# EAGLE design PFC_nano_breakout (EAGLE 7.6.0)
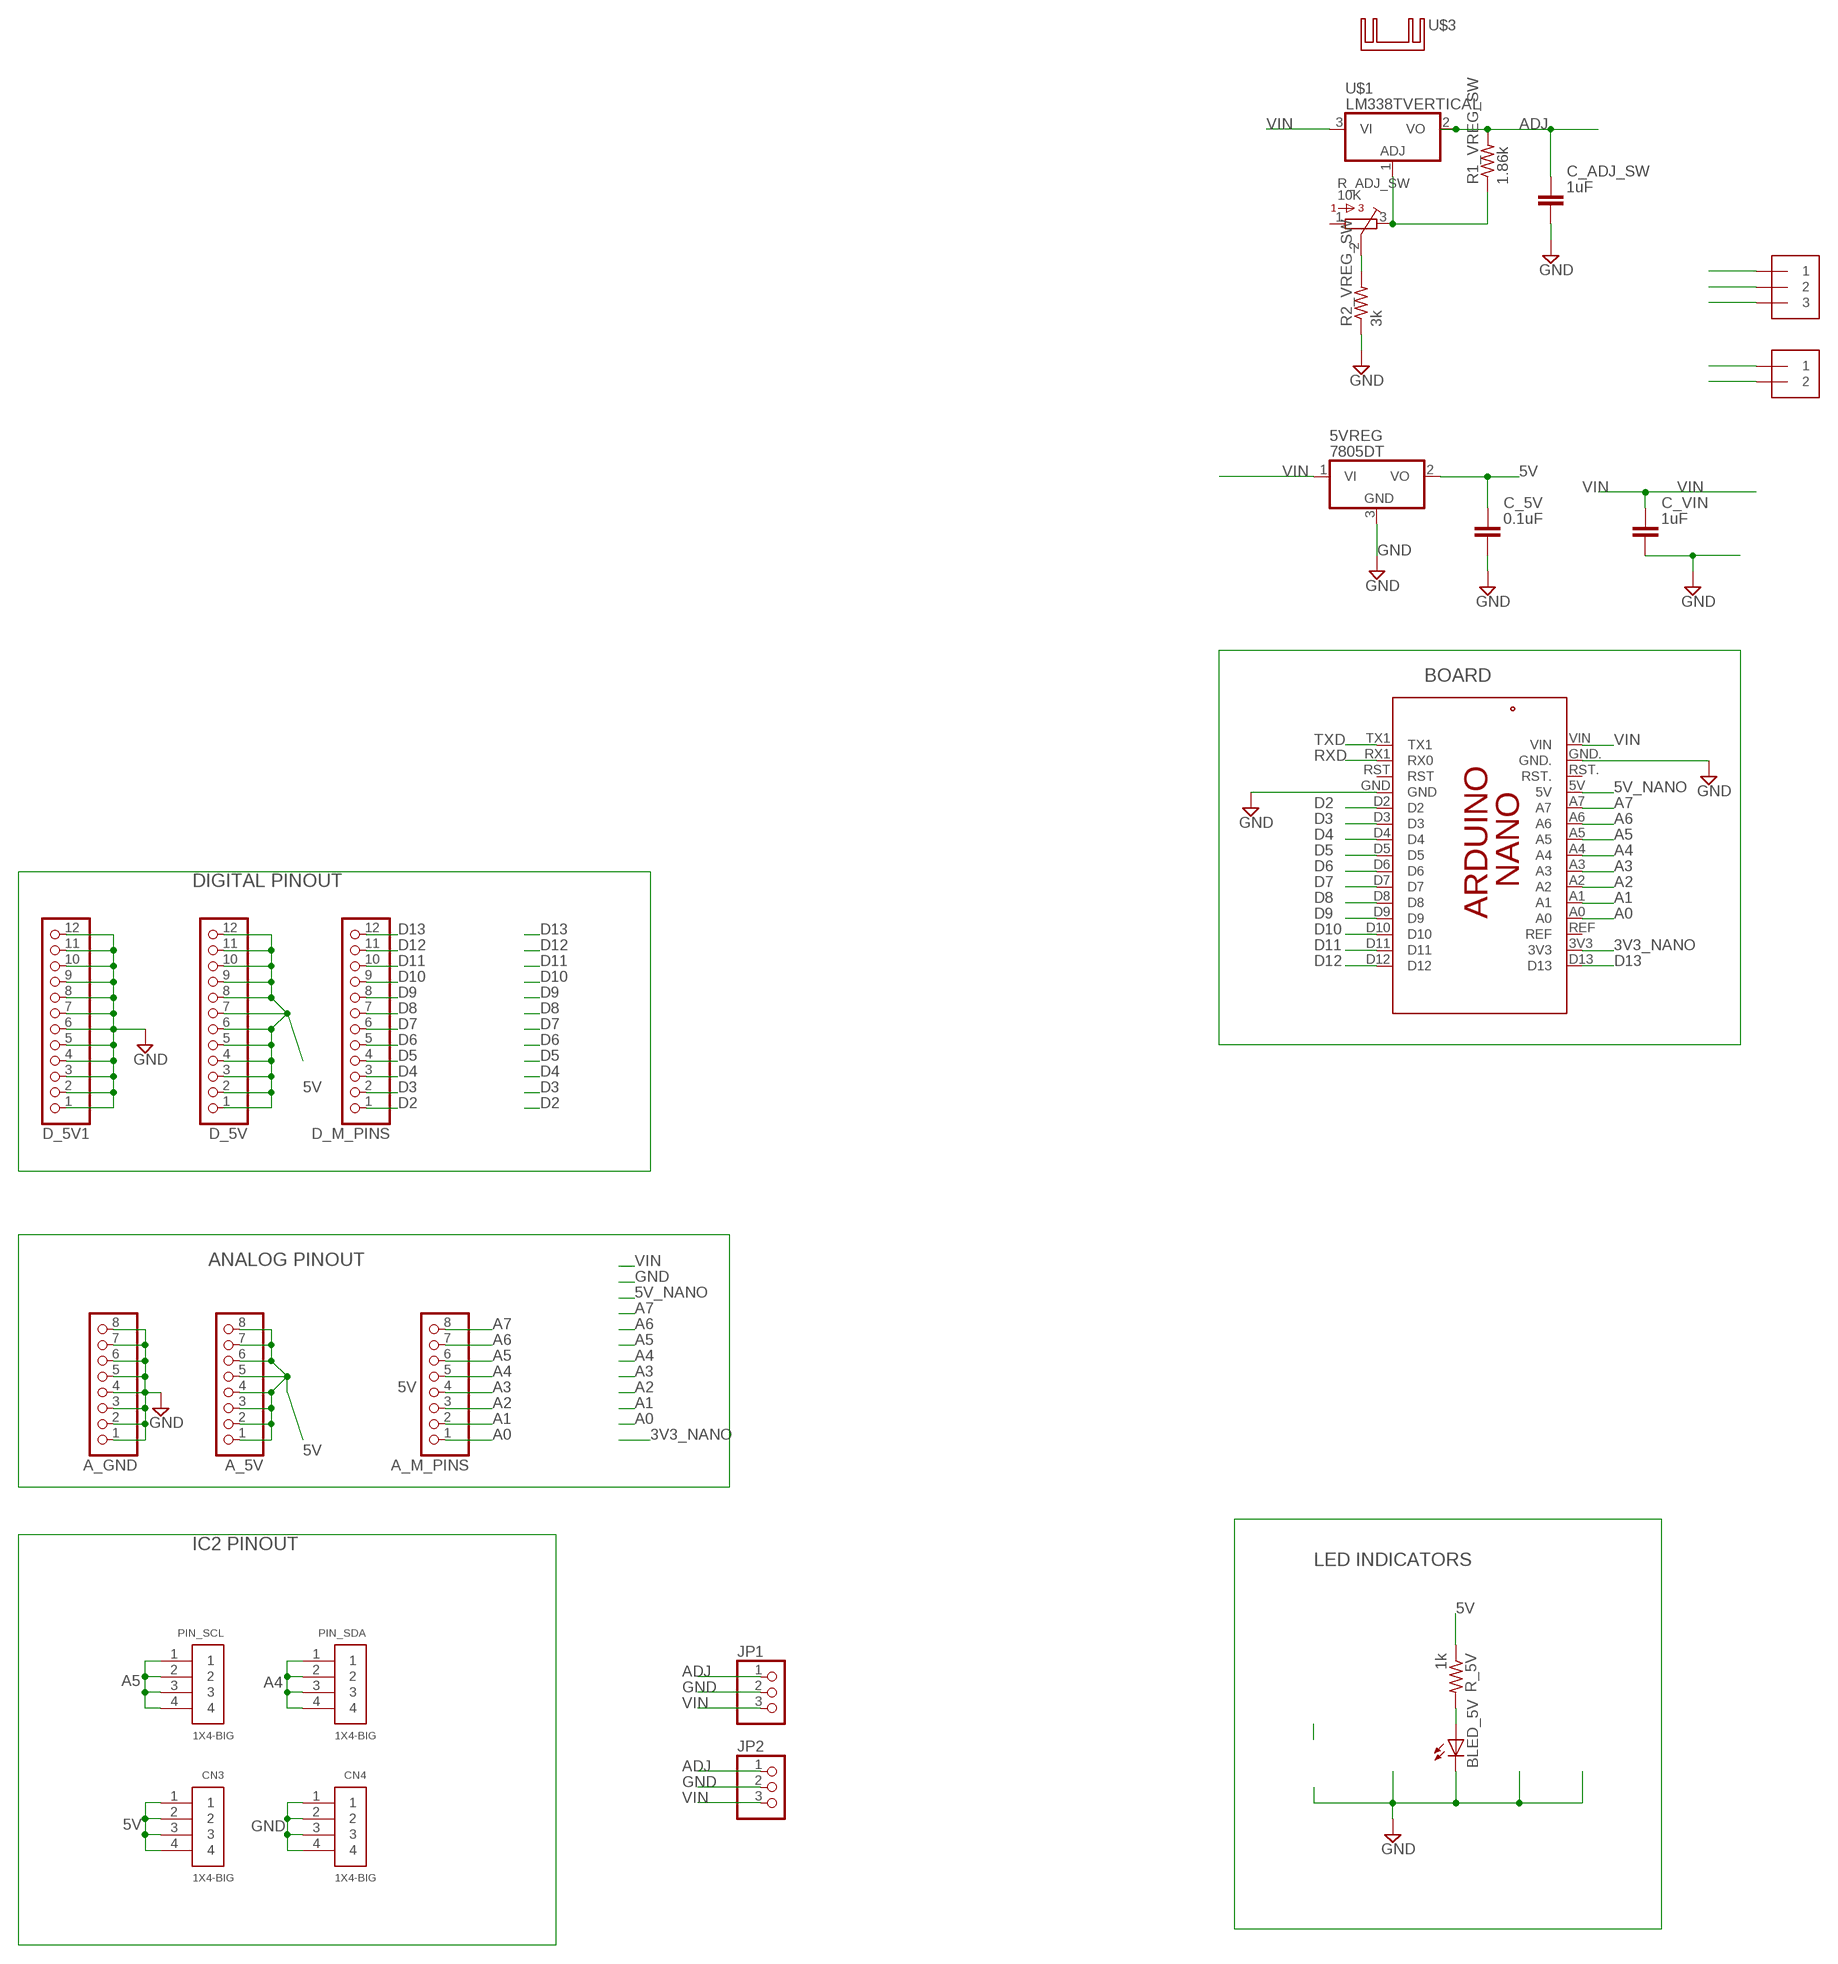
[diagram p0: schematic, sheet 1]

## Parts
5VREG  7805DT  [TO252]
A_5V  PINHD-1X8CLEANBIG  [1X08-CLEANBIG]
A_GND  PINHD-1X8CLEANBIG  [1X08-CLEANBIG]
A_M_PINS  PINHD-1X8CLEANBIG  [1X08-CLEANBIG]
BLED_5V  LEDCHIP-LED0603  [CHIP-LED0603]
C_5V  0.1uF  CAPACITOR_NPOL-0603  [C603]
C_ADJ_SW  1uF  CAPACITOR_NPOL-0603  [C603]
C_VIN  1uF  CAPACITOR_NPOL-0603  [C603]
CN3  1X4-BIG  [1X04-BIG]
CN4  1X4-BIG  [1X04-BIG]
D_5V  PINHD-1X12-CB  [1X12-CB]
D_5V1  PINHD-1X12-CB  [1X12-CB]
D_M_PINS  PINHD-1X12-CB  [1X12-CB]
J2  1X2-3.5MM  [1X2-3.5MM]
JP1  PINHD-1X3CB  [1X03-CLEANBIG]
JP2  PINHD-1X3CB  [1X03-CLEANBIG]
PCB1  ARDUINO_NANO_SHIELD  [ARDUINO_NANO_SHIELD]
PIN_SCL  1X4-BIG  [1X04-BIG]
PIN_SDA  1X4-BIG  [1X04-BIG]
R1_VREG_SW  1.86k  R-US_R0603  [R0603]
R2_VREG_SW  3k  R-US_R0603  [R0603]
R_5V  1k  R-US_R0603  [R0603]
R_ADJ_SW  10K  3386-P  [3386P]
U$1  LM338TVERTICAL  [TO220V]
U$2  1X3  [1X3-3.5MM]
U$3  FW1S  [FW1S-DOCU]

## Nets
3V3_NANO: PCB1.3V3
5V: 5VREG.2(VO) A_5V.1 A_5V.2 A_5V.3 A_5V.4 A_5V.5 A_5V.6 A_5V.7 A_5V.8 C_5V.1 CN3.1 CN3.2 CN3.3 CN3.4 D_5V.1 D_5V.2 D_5V.3 D_5V.4 D_5V.5 D_5V.6 D_5V.7 D_5V.8 D_5V.9 D_5V.10 D_5V.11 D_5V.12 R_5V.1
5V_NANO: PCB1.5V
A0: A_M_PINS.1 PCB1.A0
A1: A_M_PINS.2 PCB1.A1
A2: A_M_PINS.3 PCB1.A2
A3: A_M_PINS.4 PCB1.A3
A4: A_M_PINS.5 PCB1.A4 PIN_SDA.1 PIN_SDA.2 PIN_SDA.3 PIN_SDA.4
A5: A_M_PINS.6 PCB1.A5 PIN_SCL.1 PIN_SCL.2 PIN_SCL.3 PIN_SCL.4
A6: A_M_PINS.7 PCB1.A6
A7: A_M_PINS.8 PCB1.A7
ADJ: C_ADJ_SW.1 JP1.1 JP2.1 R1_VREG_SW.2 U$1.2(VO) U$2.2
D2: D_M_PINS.1 PCB1.D2
D3: D_M_PINS.2 PCB1.D3
D4: D_M_PINS.3 PCB1.D4
D5: D_M_PINS.4 PCB1.D5
D6: D_M_PINS.5 PCB1.D6
D7: D_M_PINS.6 PCB1.D7
D8: D_M_PINS.7 PCB1.D8
D9: D_M_PINS.8 PCB1.D9
D10: D_M_PINS.9 PCB1.D10
D11: D_M_PINS.10 PCB1.D11
D12: D_M_PINS.11 PCB1.D12
D13: D_M_PINS.12 PCB1.D13
GND: 5VREG.3(GND) A_GND.1 A_GND.2 A_GND.3 A_GND.4 A_GND.5 A_GND.6 A_GND.7 A_GND.8 BLED_5V.C C_5V.2 C_ADJ_SW.2 C_VIN.2 CN4.1 CN4.2 CN4.3 CN4.4 D_5V1.1 D_5V1.2 D_5V1.3 D_5V1.4 D_5V1.5 D_5V1.6 D_5V1.7 D_5V1.8 D_5V1.9 D_5V1.10 D_5V1.11 D_5V1.12 J2.1 JP1.2 JP2.2 PCB1.GND PCB1.GND. R2_VREG_SW.1 U$2.1
N$2: R2_VREG_SW.2 R_ADJ_SW.2
N$4: BLED_5V.A R_5V.2
N$5: R1_VREG_SW.1 R_ADJ_SW.3 U$1.1(GND)
RXD: PCB1.RX1(RX0)
TXD: PCB1.TX1
VIN: 5VREG.1(VI) C_VIN.1 J2.2 JP1.3 JP2.3 PCB1.VIN U$1.3(VI) U$2.3
Unconnected: PCB1.REF PCB1.RST PCB1.RST. R_ADJ_SW.1

## Notes on the sheet
- BOARD
- DIGITAL PINOUT
- ANALOG PINOUT
- IC2 PINOUT
- LED INDICATORS

## Library data of the parts
5VREG = adafruit:78*: Positive VOLTAGE REGULATOR Added bigger pads to the TO-92 package
A_5V A_GND A_M_PINS = adafruit:PINHD-1X8: PIN HEADER
BLED_5V = led:LED: LED OSRAM: - CHIPLED LG R971, LG N971, LY N971, LG Q971, LY Q971, LO R971, LY R971 LH N974, LH R974 LS Q976, LO Q976, LY Q976 LO Q996 - Hyper CHIPLED LW Q18S LB Q993, LB Q99A, LB R99A - SideLED LS A670, LO A670, LY A670, LG A670, LP A670 LB A673, LV A673, LT A673, LW A673 LH A674 LY A675 LS A676, LA A676, LO A676, LY A676, LW A676 LS A679, LY A679, LG A679 - Hyper Micro SIDELED® LS Y876, LA Y876, LO Y876, LY Y876 LT Y87S - SmartLED LW L88C, LW L88S LB L89C, LB L89S, LG L890 LS L89K, LO L89K, LY L89K LS L896, LA L896, LO L896, LY L896 - TOPLED LS T670, LO T670, LY T670, LG T670, LP T670 LSG T670, LSP T670, LSY T670, LOP T670, LYG T670 LG T671, LOG T671, LSG T671 LB T673, LV T673, LT T673, LW T673 LH T674 LS T676, LA T676, LO T676, LY T676, LB T676, LH T676, LSB T676, LW T676 LB T67C, LV T67C, LT T67C, LS T67K, LO T67K, LY T67K, LW E67C LS E67B, LA E67B, LO E67B, LY E67B, LB E67C, LV E67C, LT E67C LW T67C LS T679, LY T679, LG T679 LS T770, LO T770, LY T770, LG T770, LP T770 LB T773, LV T773, LT T773, LW T773 LH T774 LS E675, LA E675, LY E675, LS T675 LS T776, LA T776, LO T776, LY T776, LB T776 LHGB T686 LT T68C, LB T68C - Hyper Mini TOPLED® LB M676 - Mini TOPLED Santana® LG M470 LS M47K, LO M47K, LY M47K Source: http://www.osram.convergy.de LUXEON: - LUMILED® LXK2-PW12-R00, LXK2-PW12-S00, LXK2-PW14-U00, LXK2-PW14-V00 LXK2-PM12-R00, LXK2-PM12-S00, LXK2-PM14-U00 LXK2-PE12-Q00, LXK2-PE12-R00, LXK2-PE12-S00, LXK2-PE14-T00, LXK2-PE14-U00 LXK2-PB12-K00, LXK2-PB12-L00, LXK2-PB12-M00, LXK2-PB14-N00, LXK2-PB14-P00, LXK2-PB14-Q00 LXK2-PR12-L00, LXK2-PR12-M00, LXK2-PR14-Q00, LXK2-PR14-R00 LXK2-PD12-Q00, LXK2-PD12-R00, LXK2-PD12-S00 LXK2-PH12-R00, LXK2-PH12-S00 LXK2-PL12-P00, LXK2-PL12-Q00, LXK2-PL12-R00 Source: www.luxeon.com KINGBRIGHT: KA-3528ASYC Source: www.kingbright.com
C_5V C_ADJ_SW C_VIN = dp_devices:CAPACITOR_NPOL: Non-Polarized capacitor in various packages
CN3 CN4 PIN_SCL PIN_SDA = adafruit:1X4: 4-pin connector
D_5V D_5V1 D_M_PINS = adafruit:PINHD-1X12: PIN HEADER
J2 = adafruit:1X2: 3.5mm Terminal block http://www.ladyada.net/library/pcb/eaglelibrary.html
JP1 JP2 = adafruit:PINHD-1X3: PIN HEADER
PCB1 = E14_Arduino_revC:ARDUINO_NANO_SHIELD: Arduino Nano pinout for making a shield
R1_VREG_SW R2_VREG_SW R_5V = resistor:R-US_: RESISTOR, American symbol
R_ADJ_SW = bourns:3386-: 3386 Series 3/8" Square Trimmer
U$1 = Texas Instruments_By_element14_Batch_1:LM338T
U$2 = adafruit:1X3: 3.5mm Terminal Block
U$3 = heatsink:FW1S: Heat Sink for TO220

## Board
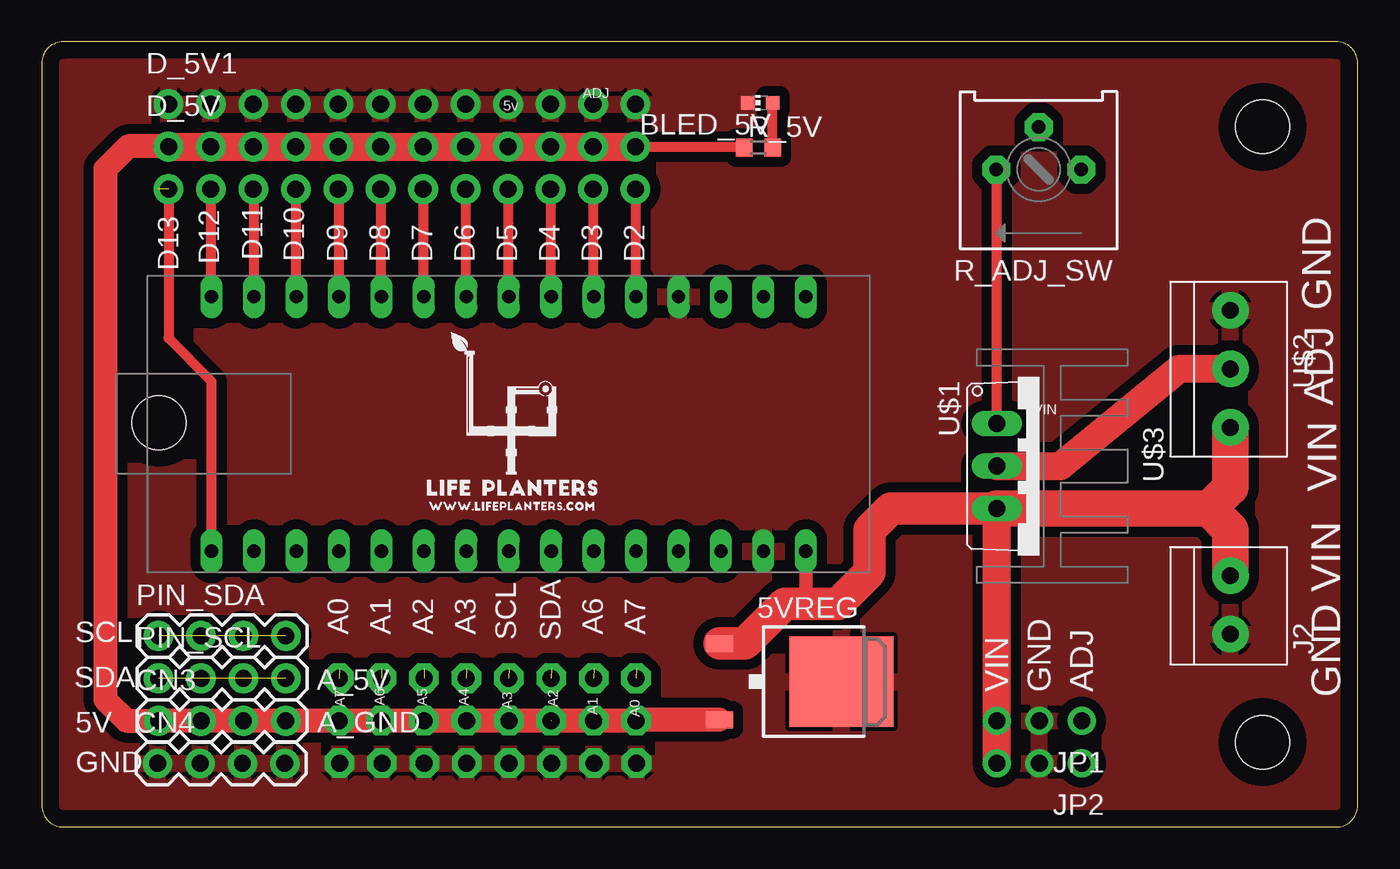
[diagram p1: board, top side]
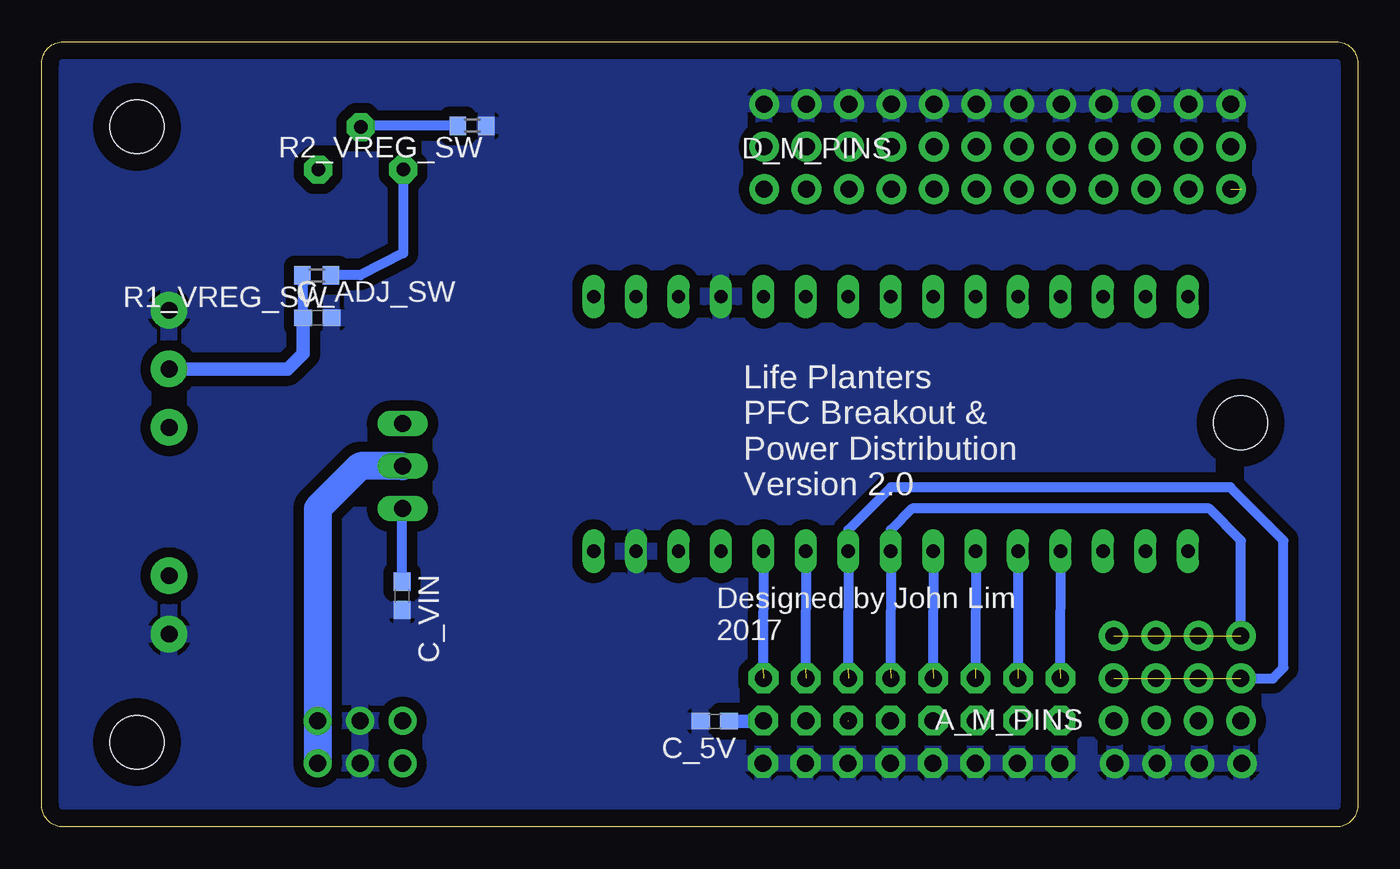
[diagram p2: board, bottom side, seen from below]

Size 78.74 x 46.99 mm. Coordinates in mm from the lower left corner, seen from the top.
Outline: 1.27,0 77.47,0 arc90 78.74,1.27 78.74,45.72 arc90 77.47,46.99 1.27,46.99 arc90 0,45.72 0,1.27 arc90 1.27,0
Copper layers (1*16): Top 0.035mm / dielectric 1.5mm / Bottom 0.035mm
Design rules "default": minimum track width 10mil, minimum drill 24mil, track to track 8mil, track to pad 8mil, pad to pad 8mil, via to via 8mil, smd to smd 8mil, copper to edge 40mil, drill to drill 8mil, minimum pad ring 10mil, minimum via ring 8mil, stop-mask expansion 4mil, vias tented up to drill 0mil, thermal gap 10mil
Holes 3.2 mm at 73.05,41.9 73.04,5.07 7.01,24.19

### Footprints (pad centres in the part's own frame; a part is rotated, then mirrored left to right if it is on the bottom)
TO252 = smd 1 x 1.6: 1 -2.28,-4.8; 2 2.28,-4.8 | smd 5.4 x 6.2: 3 0,2.5
1X08-CLEANBIG = drill 1.016 pad 1.778 octagon: 1 -8.89,0; 2 -6.35,0; 3 -3.81,0; 4 -1.27,0; 5 1.27,0; 6 3.81,0; 7 6.35,0; 8 8.89,0
CHIP-LED0603 = smd 0.8 x 0.8: A 0,-0.75; C 0,0.75
C603 = smd 1.1 x 1: 1 -0.85,0; 2 0.85,0
1X04-BIG = drill 1.016 pad 1.778: 1 0,0; 2 2.54,0; 3 5.08,0; 4 7.62,0
1X12-CB = drill 1.016 pad 1.778: 1 -13.97,0; 2 -11.43,0; 3 -8.89,0; 4 -6.35,0; 5 -3.81,0; 6 -1.27,0; 7 1.27,0; 8 3.81,0; 9 6.35,0; 10 8.89,0; 11 11.43,0; 12 13.97,0
1X2-3.5MM = drill 1 pad 2.184: 1 1.8,0; 2 -1.7,0
1X03-CLEANBIG = drill 1.016 pad 1.676: 1 -2.54,0; 2 0,0; 3 2.54,0
ARDUINO_NANO_SHIELD = drill 0.8 long: 3V3 -13.97,-7.62; 5V 11.43,-7.62; A0 -8.89,-7.62; A1 -6.35,-7.62; A2 -3.81,-7.62; A3 -1.27,-7.62; A4 1.27,-7.62; A5 3.81,-7.62; A6 6.35,-7.62; A7 8.89,-7.62; D2 8.89,7.62; D3 6.35,7.62; D4 3.81,7.62; D5 1.27,7.62; D6 -1.27,7.62; D7 -3.81,7.62; D8 -6.35,7.62; D9 -8.89,7.62; D10 -11.43,7.62; D11 -13.97,7.62; D12 -16.51,7.62; D13 -16.51,-7.62; GND 11.43,7.62; GND. 16.51,-7.62; REF -11.43,-7.62; RST 13.97,7.62; RST. 13.97,-7.62; RX1 16.51,7.62; TX1 19.05,7.62; VIN 19.05,-7.62
R0603 = smd 1 x 1.1: 1 -0.85,0; 2 0.85,0
3386P = drill 0.813 pad 1.676 octagon: 1 -2.54,0; 2 0,-2.54; 3 2.54,0
TO220V = drill 1.016 long: 1 -2.54,1.27; 2 0,1.27; 3 2.54,1.27
1X3-3.5MM = drill 1 pad 2.184: 1 2.11,3.81; 2 5.61,3.81; 3 9.11,3.81

### Placement (x,y rotation side)
5VREG  45.35,8.69 270 top
A_5V  26.68,6.36 0 top
A_GND  26.7,3.82 0 top
A_M_PINS  26.67,8.9 180 bottom
BLED_5V  42.99,43.33 90 top
C_5V  38.47,6.33 180 bottom
C_ADJ_SW  62.25,30.46 0 bottom
C_VIN  57.19,13.84 270 bottom
CN3  6.99,6.35 0 top
CN4  6.92,3.8 0 top
D_5V  21.55,40.71 0 top
D_5V1  21.55,43.25 0 top
D_M_PINS  21.55,38.17 0 bottom
J2  71.12,13.34 270 top
JP1  59.69,6.34 180 top
JP2  59.69,3.81 180 top
PCB1  26.67,24.12 0 top
PIN_SCL  6.99,8.89 0 top
PIN_SDA  6.99,11.43 0 top
R1_VREG_SW  62.29,33 180 bottom
R2_VREG_SW  52.99,41.96 180 bottom
R_5V  42.88,40.65 0 top
R_ADJ_SW  59.65,39.35 180 top
U$1  55.88,21.59 270 top
U$2  67.31,33.02 270 top
U$3  60.96,21.59 270 top

### Tracks (layer width: path | path; a pad name or v marks a point on that pad's centre or on a via)
5V  (1 unrouted)
  Top 0.61: D_5V.12 41.97,40.71 R_5V.1
  Top 1.422: 7.55,40.74 5.18,40.74 3.81,39.37 3.81,7.62 5.08,6.35 CN3.1 CN3.2 CN3.3 CN3.4 13.98,6.36 A_5V.1 A_5V.2 A_5V.3 A_5V.4 A_5V.5 | A_5V.5 A_5V.6 A_5V.7 A_5V.8 35.62,6.41 5VREG.2 | A_5V.5
  Top 1.676: 7.55,40.74 D_5V.1 D_5V.2 D_5V.3 D_5V.4 D_5V.5 D_5V.6 D_5V.7 D_5V.8 D_5V.9 D_5V.10 D_5V.11 D_5V.12
  Bottom 0.813: C_5V.1 35.6,6.33 A_5V.8
A0  (1 unrouted)
  Bottom 0.61: PCB1.A0 17.81,9.49
A1  (1 unrouted)
  Bottom 0.61: PCB1.A1 20.34,9.48
A2  (1 unrouted)
  Bottom 0.61: PCB1.A2 22.88,9.48
A3  (1 unrouted)
  Bottom 0.61: PCB1.A3 25.42,9.48
A4  (4 unrouted)
  Bottom 0.61: 27.97,9.49 PCB1.A4 27.94,17.78 26.67,19.05 8.89,19.05 6.99,17.15 PIN_SDA.1
A5  (4 unrouted)
  Bottom 0.61: 30.5,9.48 PCB1.A5 30.48,17.78 27.94,20.32 7.62,20.32 4.45,17.15 4.45,9.52 5.08,8.89 PIN_SCL.1
A6  (1 unrouted)
  Bottom 0.61: PCB1.A6 33.05,9.49
A7  (1 unrouted)
  Bottom 0.61: PCB1.A7 35.58,9.48
ADJ
  Top 1.676: U$1.2 60.96,21.59 68.05,27.41 U$2.2
  Bottom 0.61: C_ADJ_SW.1 63.1,32.96 R1_VREG_SW.2
  Bottom 0.813: U$2.2 64.03,27.41 63.1,28.34 C_ADJ_SW.1
  Bottom 1.676: U$1.2 59.69,21.59 62.23,19.05 JP1.1 JP2.1
D2
  Top 0.61: D_M_PINS.1 35.52,31.78 PCB1.D2
D3
  Top 0.61: PCB1.D3 33.02,38.13 D_M_PINS.2
D4
  Top 0.61: D_M_PINS.3 30.44,31.78 PCB1.D4
D5
  Top 0.61: PCB1.D5 27.94,38.13 D_M_PINS.4
D6
  Top 0.61: D_M_PINS.5 25.36,31.78 PCB1.D6
D7
  Top 0.61: PCB1.D7 22.86,38.13 D_M_PINS.6
D8
  Top 0.61: D_M_PINS.7 20.28,31.78 PCB1.D8
D9
  Top 0.61: PCB1.D9 17.78,38.13 D_M_PINS.8
D10
  Top 0.61: D_M_PINS.9 15.2,31.78 PCB1.D10
D11
  Top 0.61: PCB1.D11 12.7,38.13 D_M_PINS.10
D12
  Top 0.61: D_M_PINS.11 10.12,31.78 PCB1.D12
D13  (1 unrouted)
  Top 0.406: 6.91,38.15 6.92,38.17
  Top 0.61: PCB1.D13 10.16,26.67 7.58,29.25 D_M_PINS.12
GND
  pour Top (isolate 0.61): 0.51,0.61 77.94,0.61 77.99,46.34 0.66,46.44
  pour Bottom (isolate 0.61): 0.61,46.38 0.61,0.76 68.38,0.76 77.91,0.73 78.22,46.38
N$2
  Bottom 0.61: R2_VREG_SW.2 59.58,41.96 R_ADJ_SW.2
N$4
  Top 0.61: R_5V.2 BLED_5V.A
N$5
  Top 0.61: U$1.1 57.15,39.31 R_ADJ_SW.3
  Bottom 0.61: R_ADJ_SW.3 57.11,34.33 59.69,33.02 61.43,33.02 R1_VREG_SW.1
VIN
  Top 0.813: PCB1.VIN 45.72,13.34
  Top 1.676: U$1.3 JP1.3 JP2.3
  Top 1.93: 5VREG.1 42.09,10.97 44.45,13.34 45.72,13.34 47.62,13.34 49.53,15.24 49.53,17.78 50.8,19.05 54.61,19.05 55.88,19.05 U$1.3
  Top 2.184: 71.12,16.51 J2.2 71.12,17.78 69.85,19.05 | U$1.3 69.85,19.05 | U$2.3 71.12,20.32 69.85,19.05
  Bottom 0.61: C_VIN.1 57.19,19.02 U$1.3

### Text on the board
tPlace: GND | ADJ | VIN | VIN | VIN | GND | ADJ | GND
bPlace: Life Planters / PFC Breakout & / Power Distribution / Version 2.0 | Designed by John Lim / 2017
tSilk: D13 | D12 | D11 | D10 | D9 | D8 | D7 | D6 | D5 | D4 | D3 | D2 | VIN | A0 | A1 | A2 | A3 | A6 | A7 | SCL | SCL | SDA | SDA | A6 | A5 | A4 | A7 | A3 | A2 | A1 | A0 | 5V | GND
_tsilk: ADJ | 5v